# Altium schematic sheet 0163_V1P8_PCIE5 GENERAT.SchDoc
size 848 x 558 mm
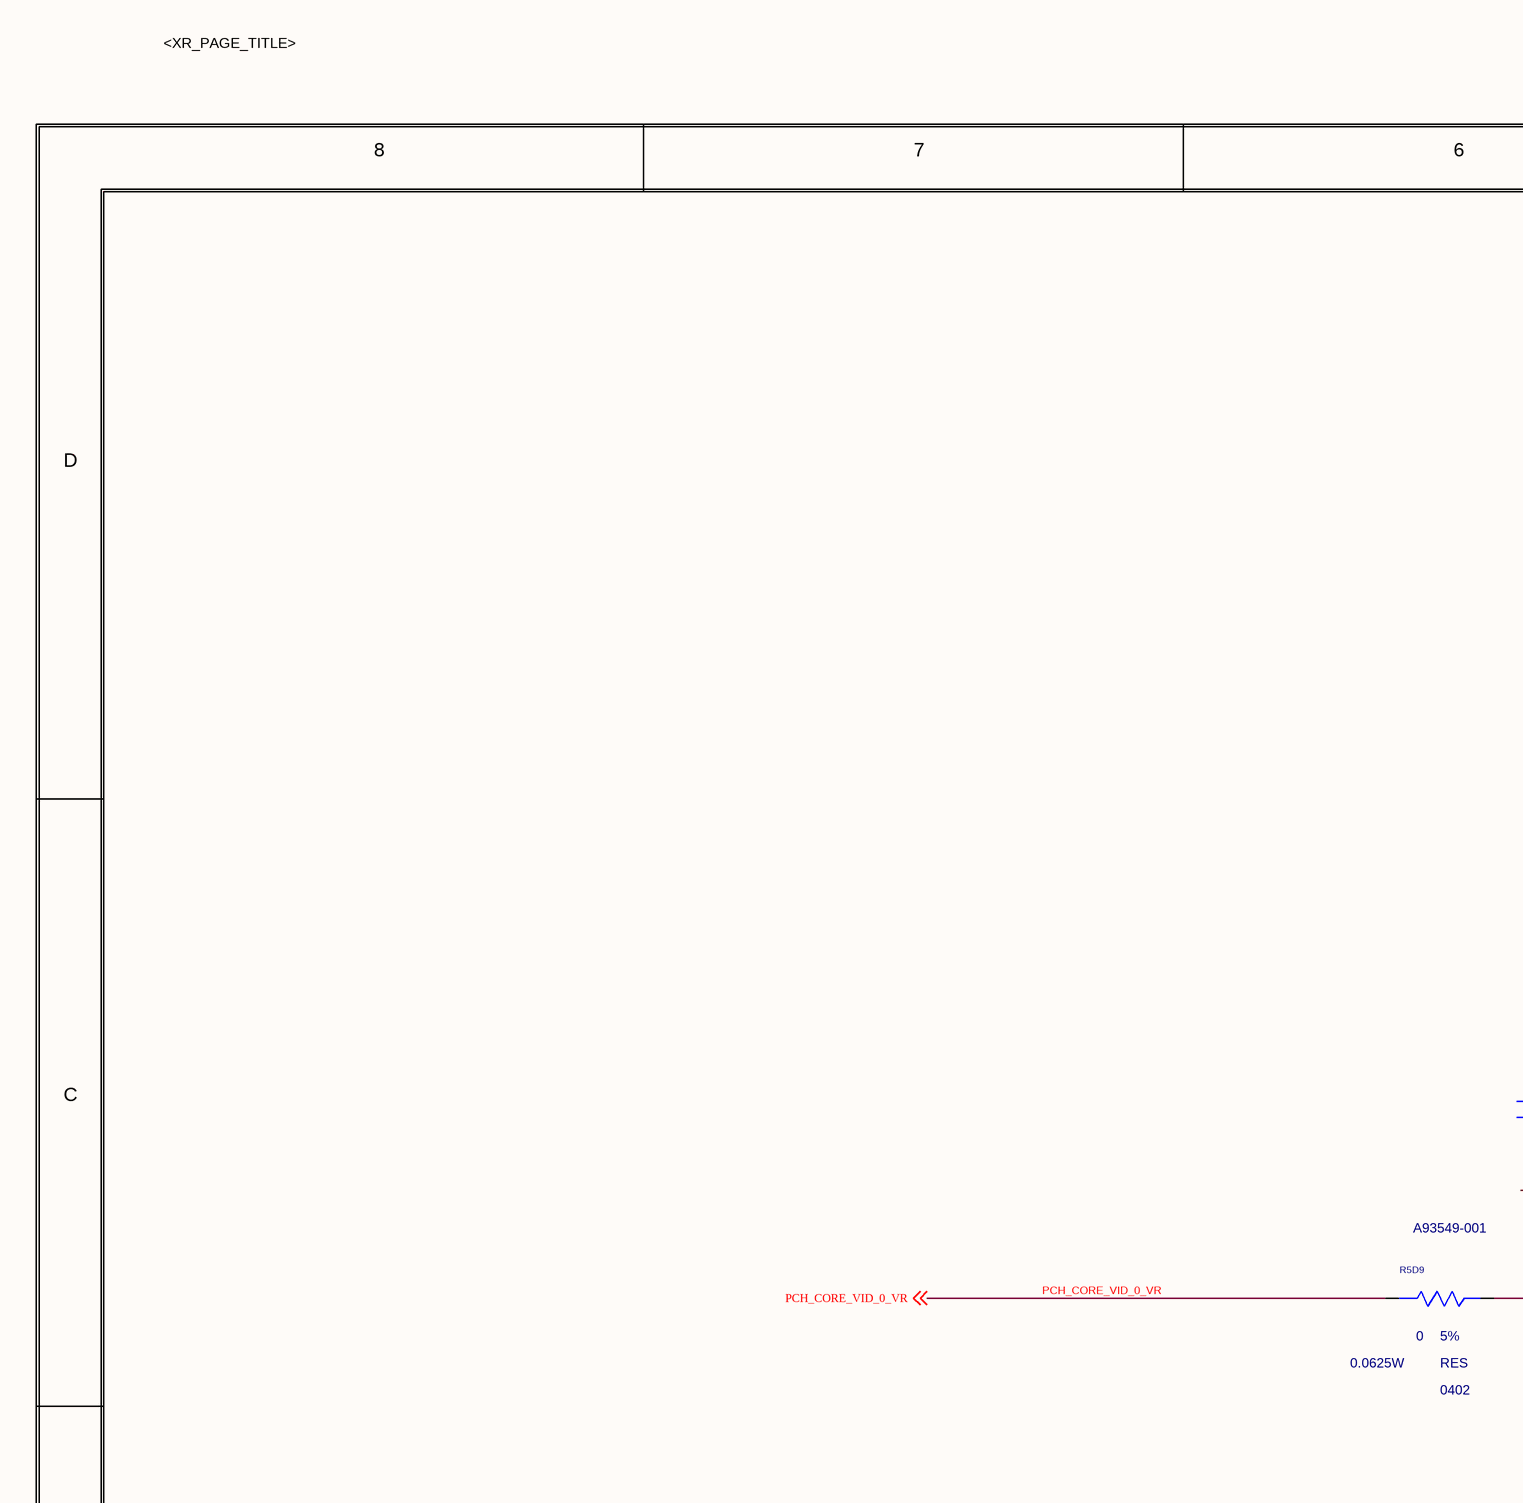
[diagram p0: 0163_V1P8_PCIE5 GENERAT.SchDoc, top left]
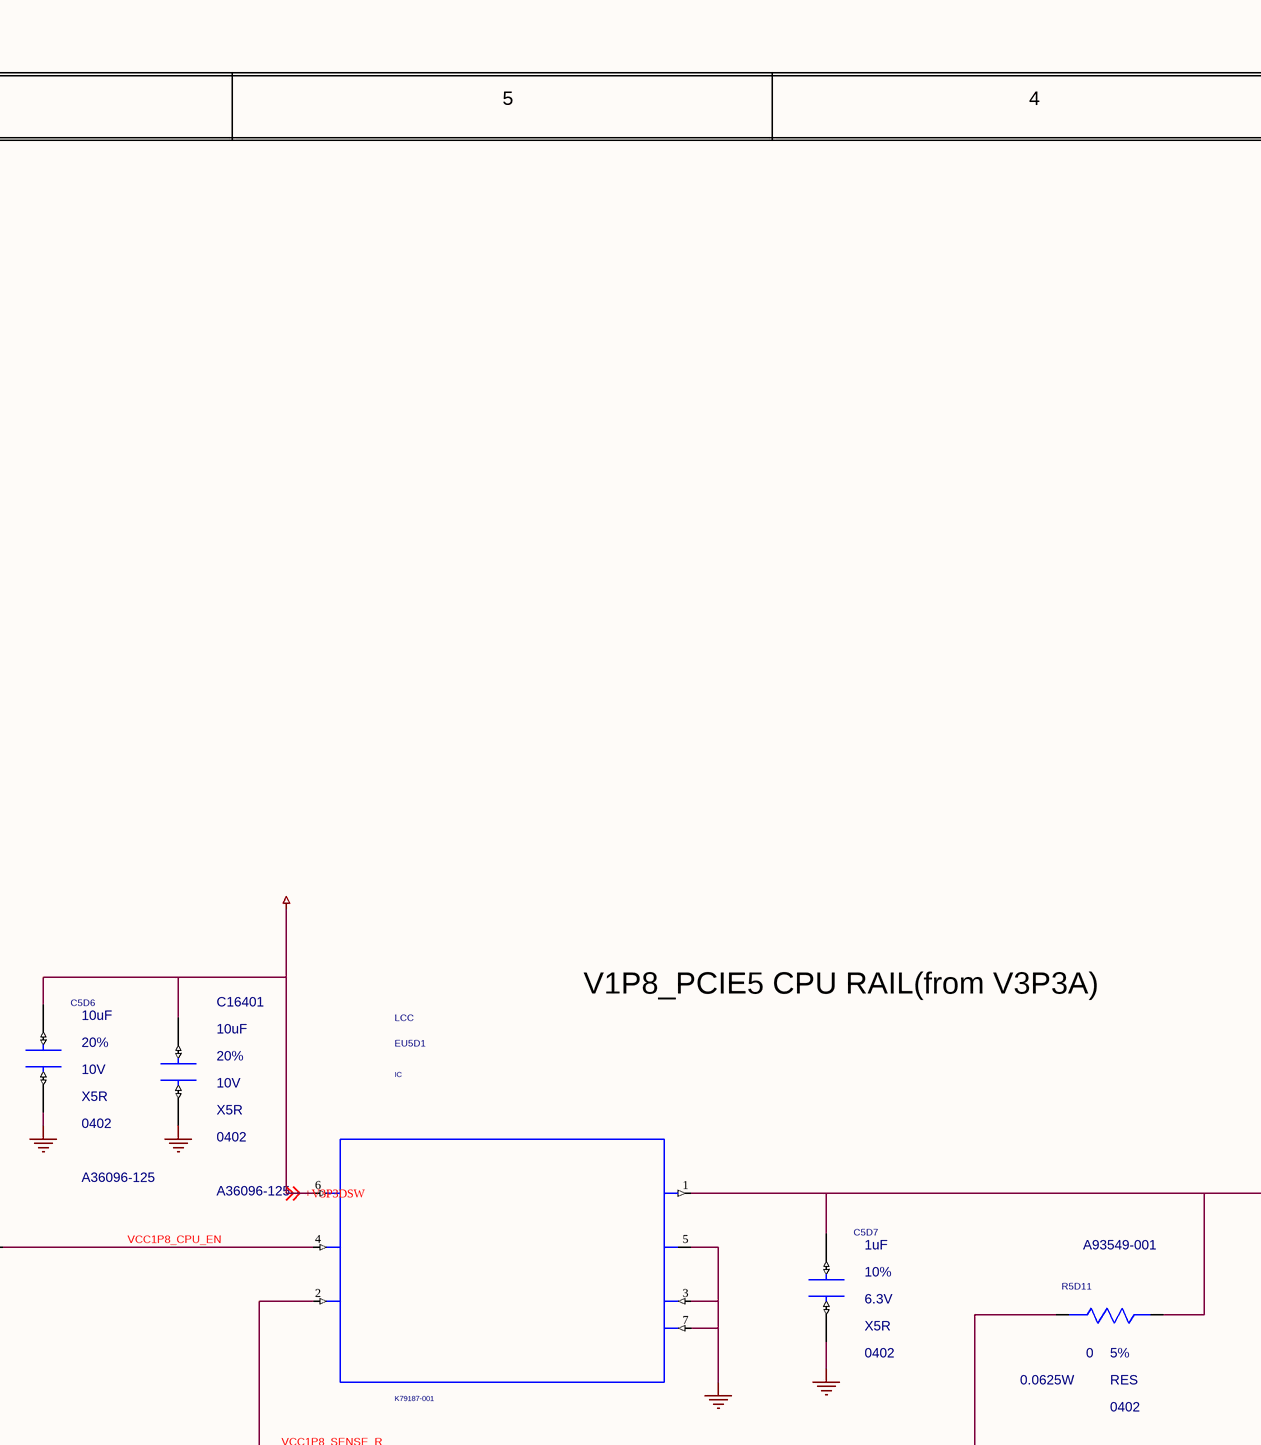
[diagram p1: 0163_V1P8_PCIE5 GENERAT.SchDoc, top middle]
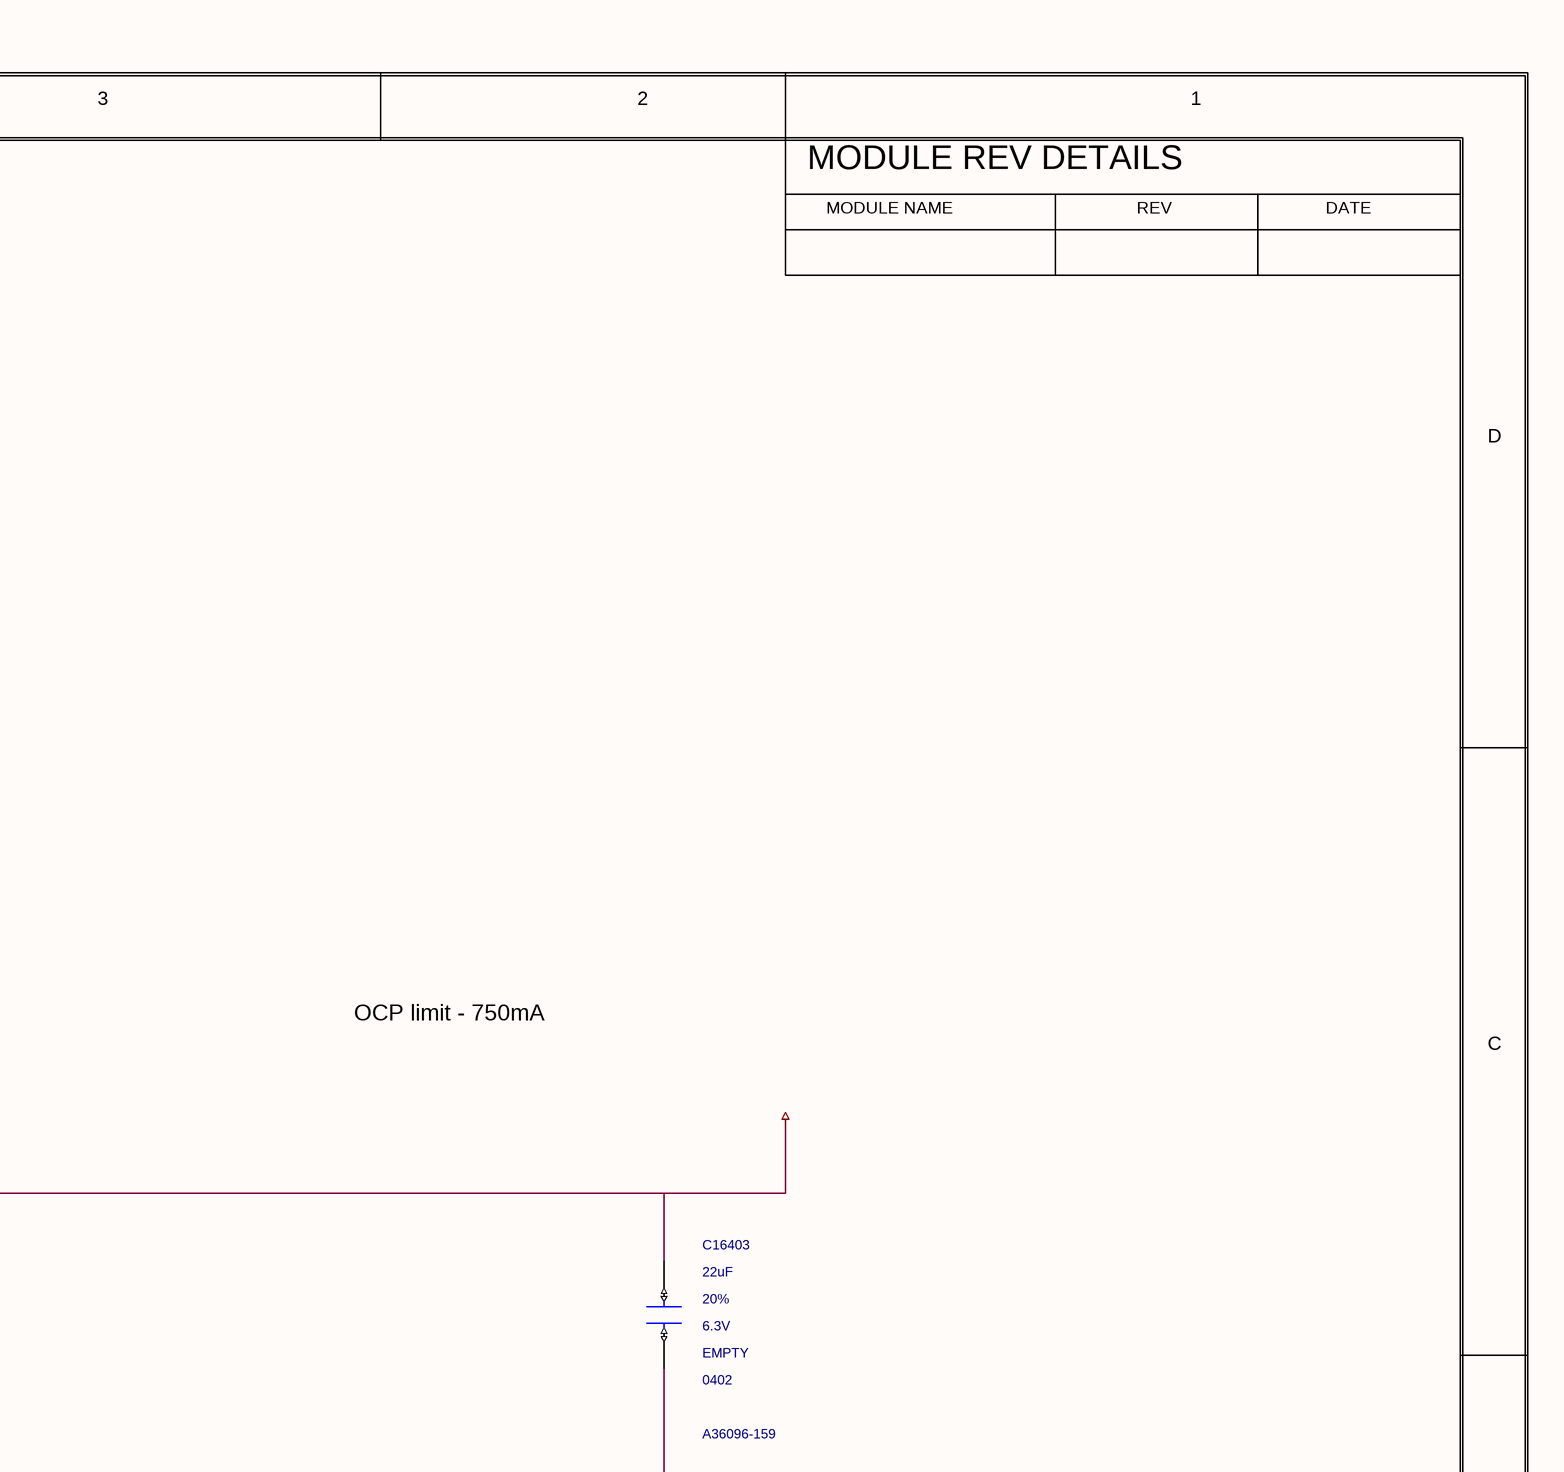
[diagram p2: 0163_V1P8_PCIE5 GENERAT.SchDoc, top right]
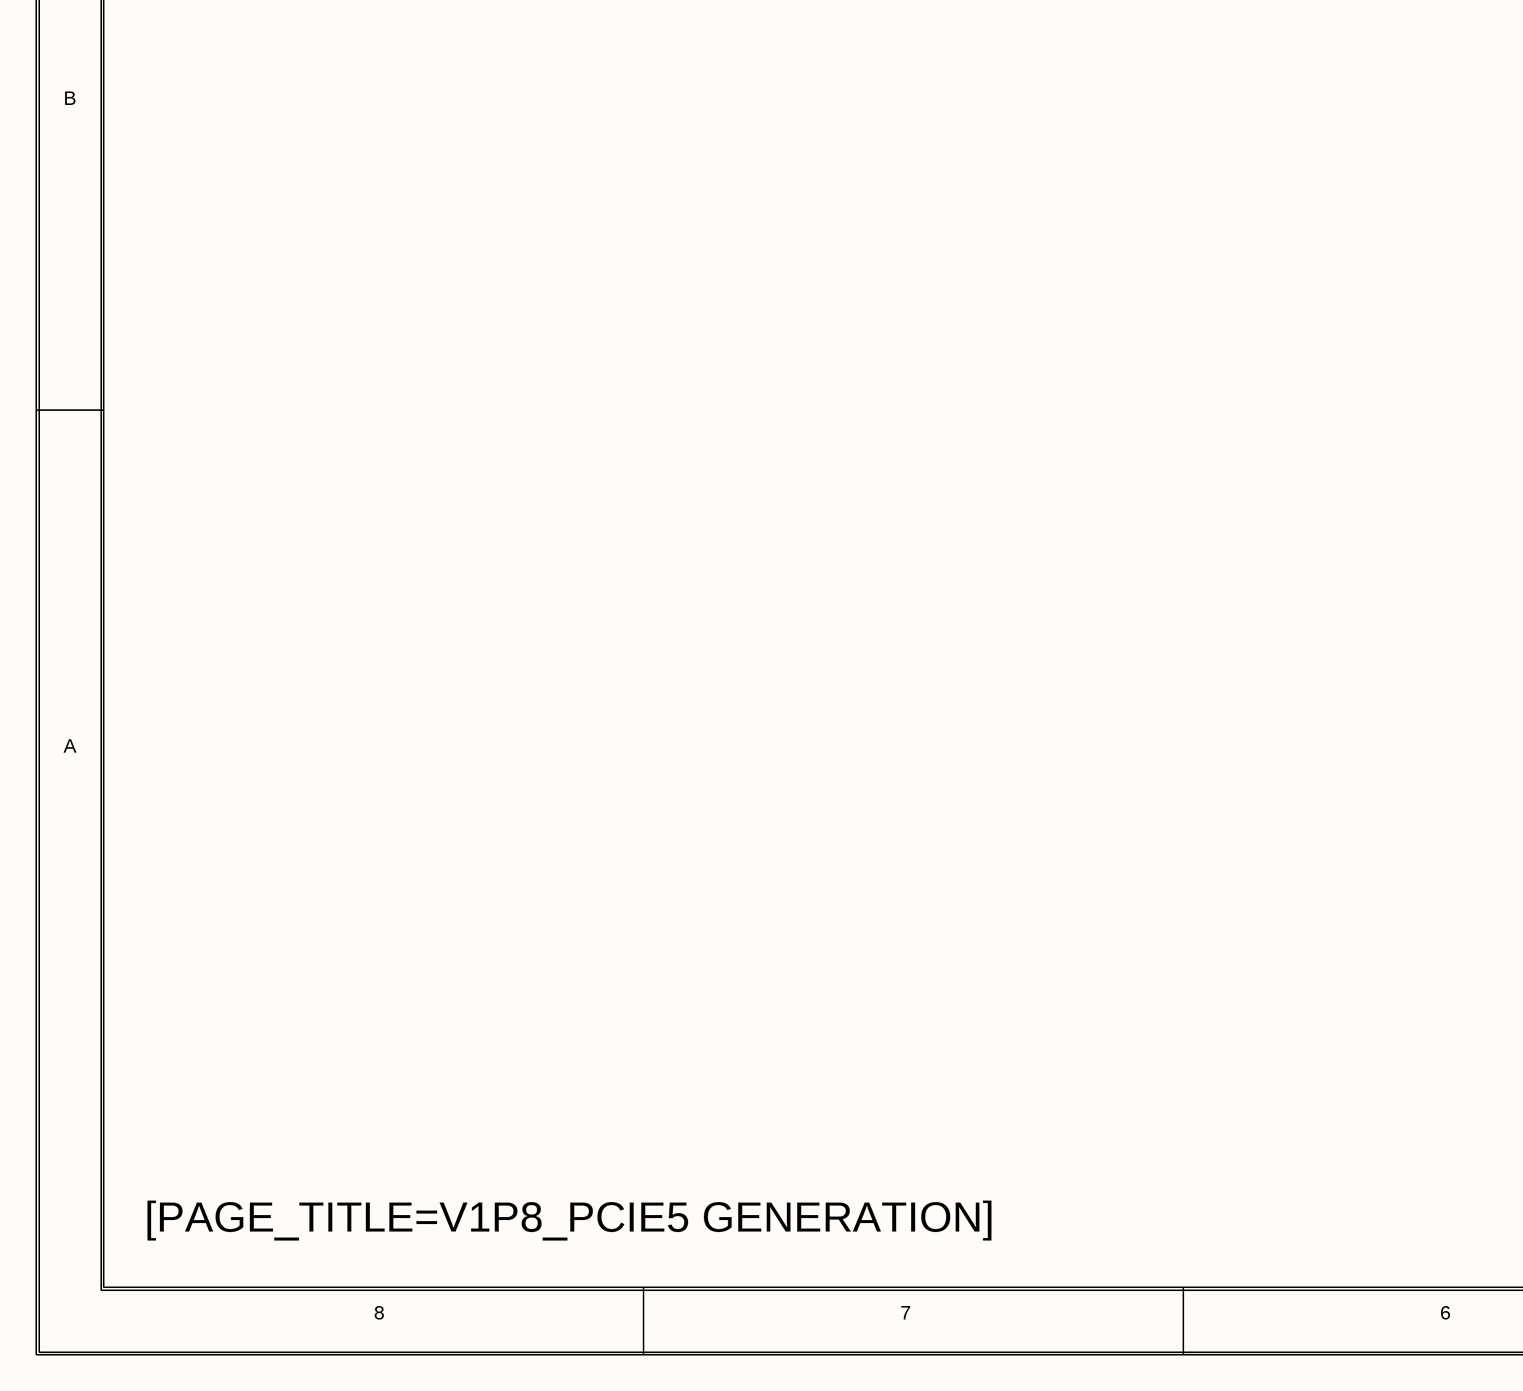
[diagram p3: 0163_V1P8_PCIE5 GENERAT.SchDoc, bottom left]
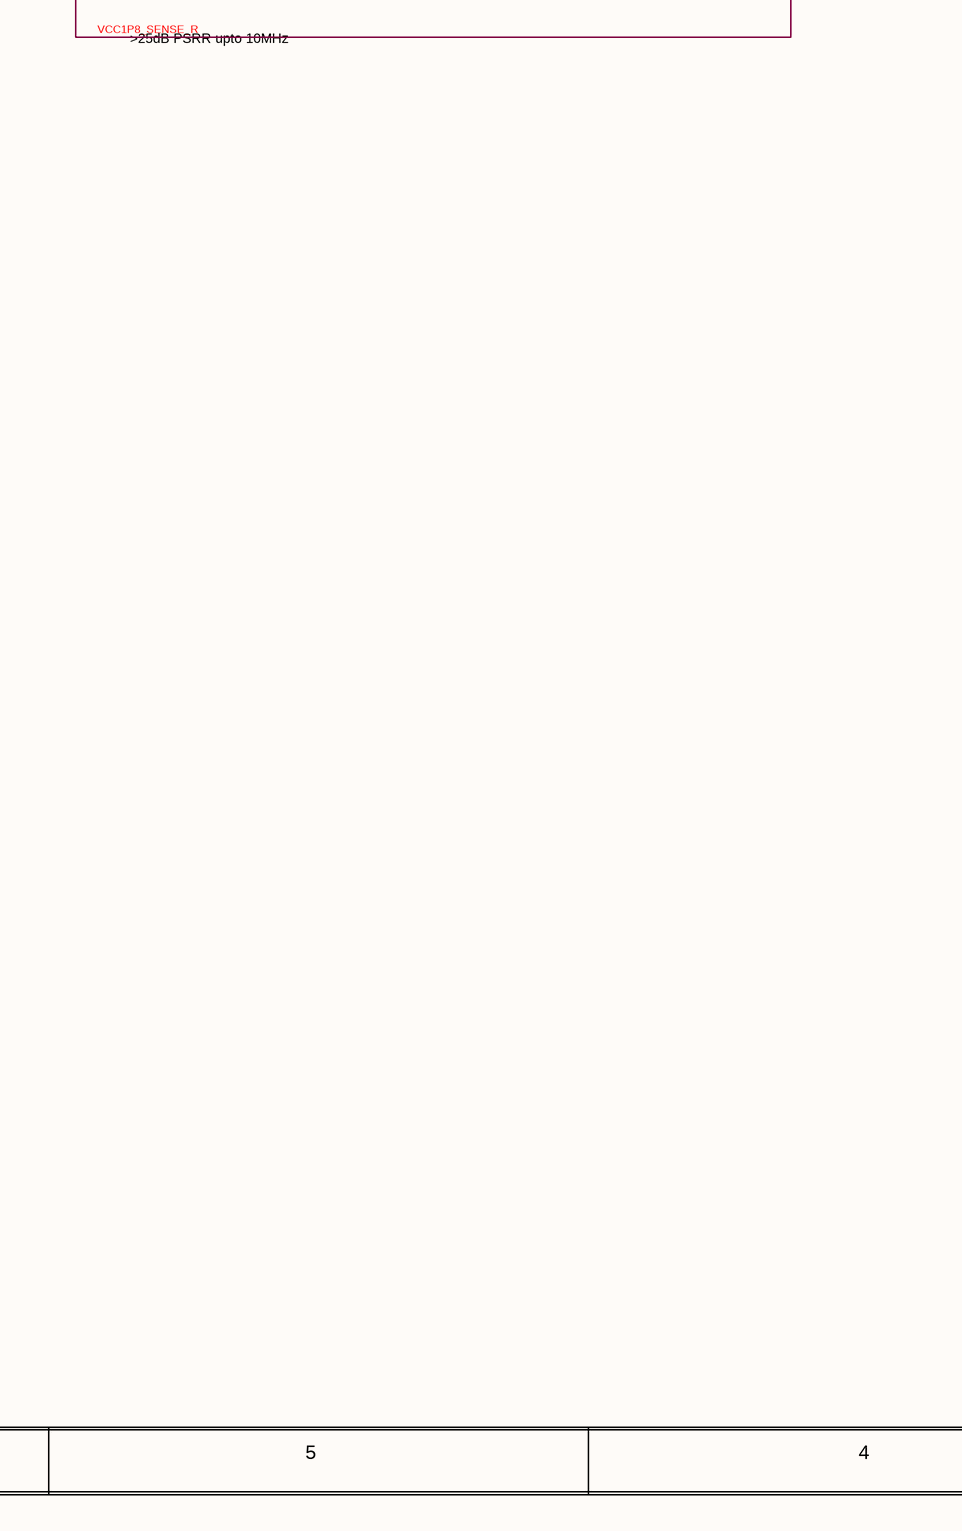
[diagram p4: 0163_V1P8_PCIE5 GENERAT.SchDoc, bottom middle]
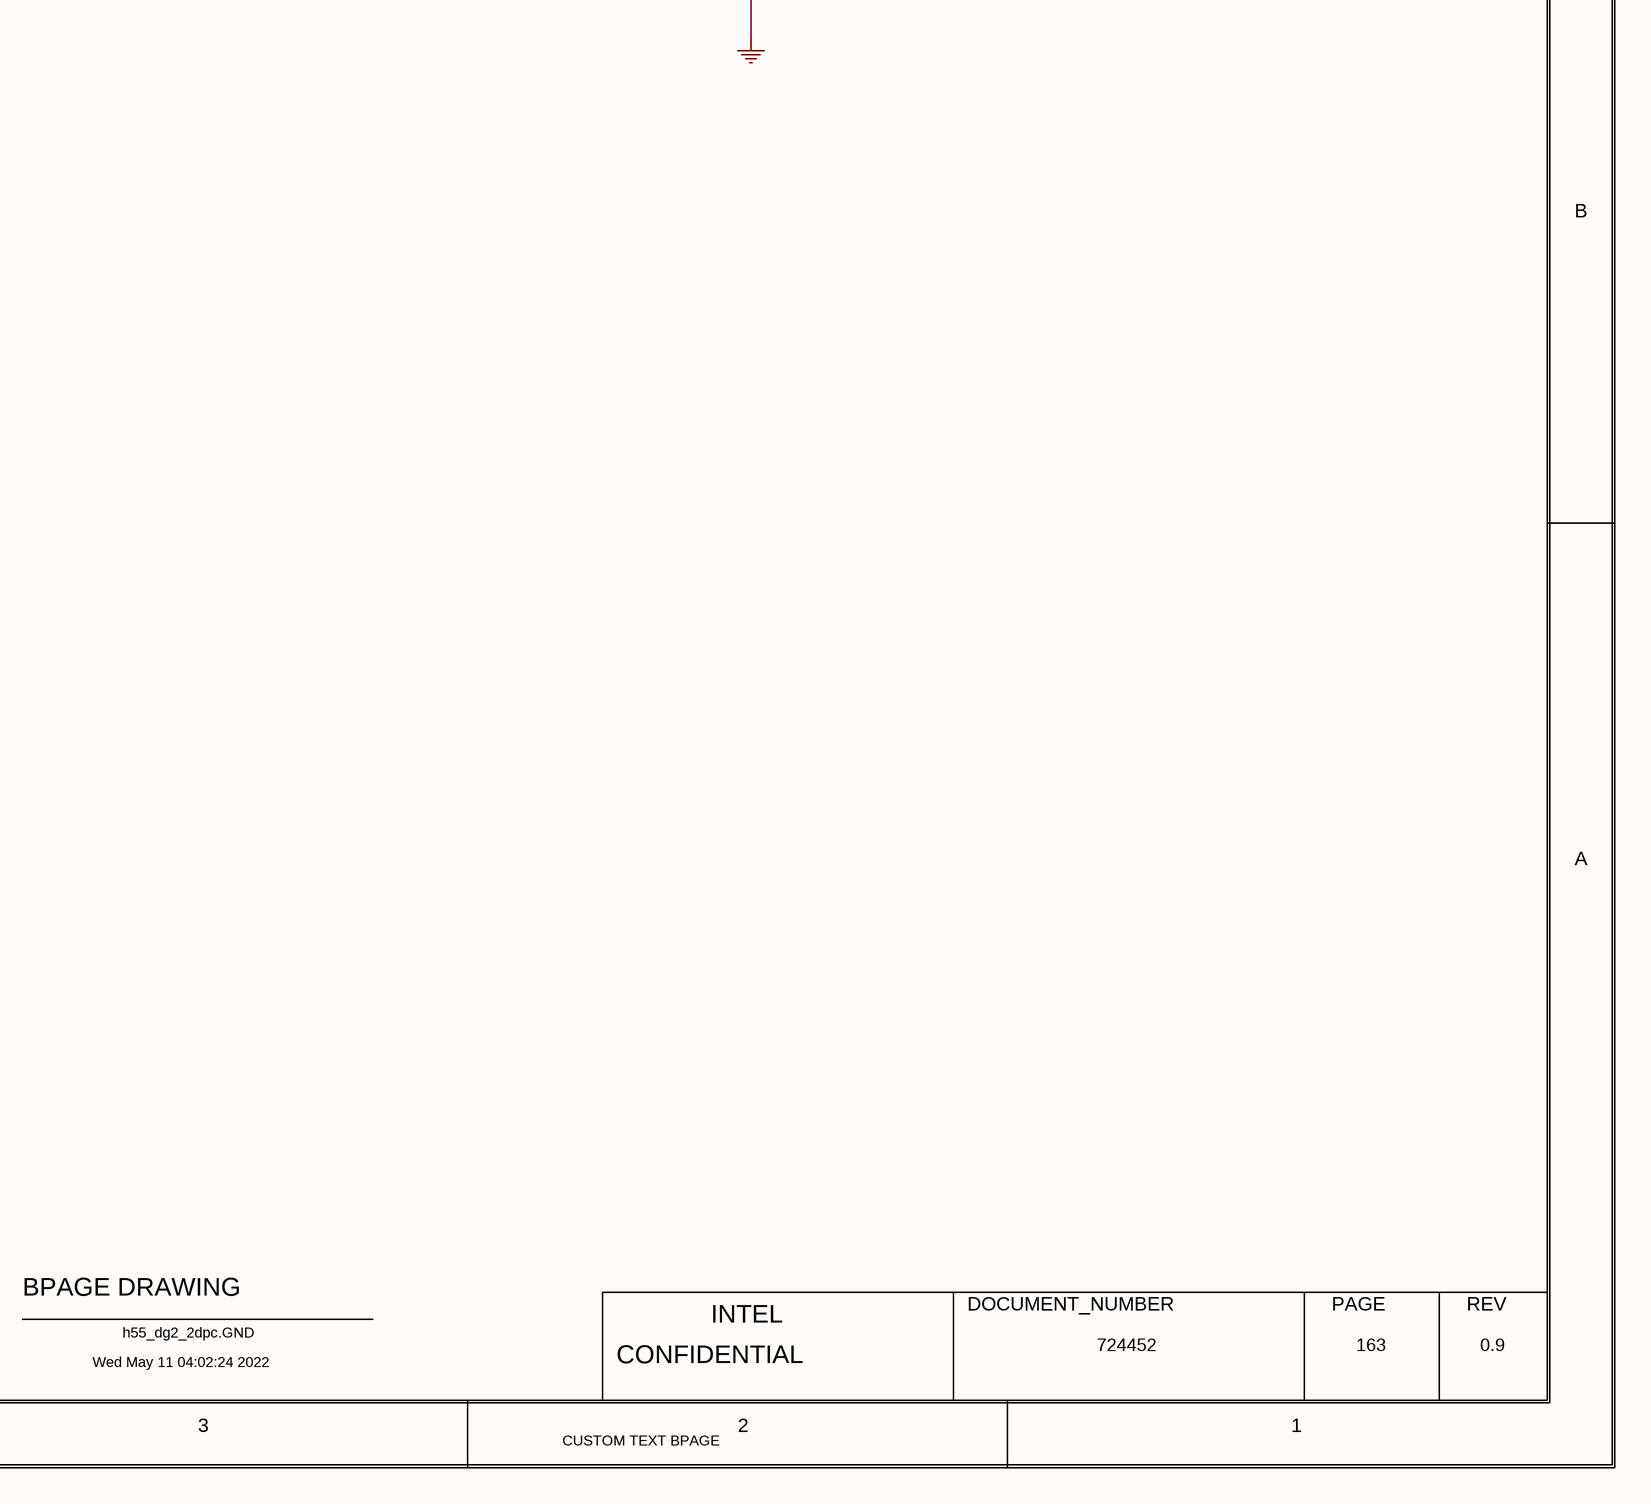
[diagram p5: 0163_V1P8_PCIE5 GENERAT.SchDoc, bottom right]

## Parts
C5D6  10uF  MATERIAL: X5R  PACK_TYPE: 0402  PART_NUMBER: A36096-125  TOLERANCE: 20%  VOLTAGE: 10V  [CTK0_SM0402_1220X700_MA]
C5D7  1uF  MATERIAL: X5R  PACK_TYPE: 0402  TOLERANCE: 10%  VOLTAGE: 6.3V  [CTK2_SM0402_1050X550_MA]
C16401  10uF  MATERIAL: X5R  PACK_TYPE: 0402  PART_NUMBER: A36096-125  TOLERANCE: 20%  VOLTAGE: 10V  [CTK0_SM0402_1220X700_MA]
C16403  22uF  MATERIAL: EMPTY  PACK_TYPE: 0402  PART_NUMBER: A36096-159  TOLERANCE: 20%  VOLTAGE: 6.3V  [CTK0_SM0402_1300X800_MA]
EU5D1  MATERIAL: IC  PACK_TYPE: LCC  PART_NUMBER: K79187-001  [TK1_LCC6_S1250_400_DF300X940_MA]  (hidden comment: NCP176_2)
R5D9  0  MATERIAL: RES  PACK_TYPE: 0402  PART_NUMBER: A93549-001  TOLERANCE: 5%  WATTAGE: 0.0625W  [CTK0_SM0402_1100X550_MA]
R5D11  0  MATERIAL: RES  PACK_TYPE: 0402  PART_NUMBER: A93549-001  TOLERANCE: 5%  WATTAGE: 0.0625W  [CTK0_SM0402_1100X550_MA]

## Nets
+V3P3DSW: C5D6.1(A) C16401.1(A) EU5D1.6(IN) ; off-sheet +V3P3DSW
+VCC1P8_PROC: C5D7.1(A) C16403.1(A) EU5D1.1(OUT) R5D11.2(B)
GND: C5D6.2(B) C5D7.2(B) C16401.2(B) C16403.2(B) EU5D1.3(GND) EU5D1.5(NC) EU5D1.7(GND_TPD)
PCH_CORE_VID_0_VR: R5D9.1(A) ; off-sheet PCH_CORE_VID_0_VR
VCC1P8_CPU_EN: EU5D1.4(EN) R5D9.2(B)
VCC1P8_SENSE_R: EU5D1.2(FB) R5D11.1(A)

## Notes on the sheet
- <XR_PAGE_TITLE>
- 8
- 7
- 6
- 5
- 4
- 3
- 2
- 1
- MODULE REV DETAILS
- MODULE NAME
- REV
- DATE
- D
- V1P8_PCIE5 CPU RAIL(from V3P3A)
- C
- OCP limit - 750mA
- >25dB PSRR upto 10MHz
- B
- A
- BPAGE DRAWING
- INTEL
- DOCUMENT_NUMBER
- PAGE
- [PAGE_TITLE=V1P8_PCIE5 GENERATION]
- Wed May 11 04:02:24 2022
- h55_dg2_2dpc.GND
- CONFIDENTIAL
- 724452
- 163
- 0.9
- CUSTOM TEXT BPAGE

## Library data of the parts
C5D6 = C_CAP: CDS_PHYS_PART_NAME: C_CAP_0402-A36096-125,X5R,10UF,10V,20%,TK0,GENERIC; CDS_LMAN_SYM_OUTLINE: -50,50,50,-50; FP_TECH: TK0; IP: GENERIC; ROOM: NONE; OriginalSymbolOrigin: (-50,25); XY: (-8200,4200); VER: 1; ROT: 0; PHYS_PAGE: 163; LOCATION: C5D6; DRAWING: @RVP1_ADL_SB_ADP_S_DDR5_SODIMM_2DPC_LIB.H55_DG2_2DPC(SCH_1):PAGE532; CDS_LIB: c_discrete; VARIANT: ?; PCB Footprint: CTK0_SM0402_1220X700_MA; CHIPS_PART_NAME: C_CAP; CDS_PART_NAME: C_CAP_0402-A36096-125,X5R,10UF,10V,20%,TK0,GENERIC; CDS_LOCATION: C5D6; ASI_MODEL: A36096-125
C5D7 = C_CAP: PART_NUMBER: A36096-027; CDS_PHYS_PART_NAME: CAP_402-1UF,10%,16V"; CDS_PART_NAME: C_CAP_0402-A36096-027,X5R,1UF,6.3V,10%,TK2,GENERIC; CDS_LMAN_SYM_OUTLINE: -50,50,50,-50; FP_TECH: TK2; IP: GENERIC; ROOM: NONE; OriginalSymbolOrigin: (-50,25); XY: (-6750,3775); VER: 1; ROT: 0; PHYS_PAGE: 163; LOCATION: C5D7; DRAWING: @RVP1_ADL_SB_ADP_S_DDR5_SODIMM_2DPC_LIB.H55_DG2_2DPC(SCH_1):PAGE532; CDS_LIB: c_discrete; VARIANT: ?; PCB Footprint: CTK2_SM0402_1050X550_MA; CHIPS_PART_NAME: C_CAP; CDS_LOCATION: C5D7; ASI_MODEL: A36096-027
C16401 = C_CAP: CDS_PHYS_PART_NAME: C_CAP_0402-A36096-125,X5R,10UF,10V,20%,TK0,GENERIC; CDS_LMAN_SYM_OUTLINE: -50,50,50,-50; FP_TECH: TK0; IP: GENERIC; ROOM: NONE; OriginalSymbolOrigin: (-50,25); XY: (-7950,4175); VER: 1; ROT: 0; PHYS_PAGE: 163; LOCATION: C16401; DRAWING: @RVP1_ADL_SB_ADP_S_DDR5_SODIMM_2DPC_LIB.H55_DG2_2DPC(SCH_1):PAGE532; CDS_LIB: c_discrete; VARIANT: ?; PCB Footprint: CTK0_SM0402_1220X700_MA; CHIPS_PART_NAME: C_CAP; CDS_PART_NAME: C_CAP_0402-A36096-125,X5R,10UF,10V,20%,TK0,GENERIC; CDS_LOCATION: C16401; ASI_MODEL: A36096-125
C16403 = C_CAP: CDS_PHYS_PART_NAME: C_CAP_0402-A36096-159,EMPTY,22UF,6.3V,20%,TK0,GENERIC; CDS_LMAN_SYM_OUTLINE: -50,50,50,-50; FP_TECH: TK0; IP: GENERIC; ROOM: NONE; OriginalSymbolOrigin: (-50,25); XY: (-4325,3725); VER: 1; ROT: 0; PHYS_PAGE: 163; LOCATION: C16403; DRAWING: @RVP1_ADL_SB_ADP_S_DDR5_SODIMM_2DPC_LIB.H55_DG2_2DPC(SCH_1):PAGE532; CDS_LIB: c_discrete; VARIANT: ?; PCB Footprint: CTK0_SM0402_1300X800_MA; CHIPS_PART_NAME: C_CAP; CDS_PART_NAME: C_CAP_0402-A36096-159,EMPTY,22UF,6.3V,20%,TK0,GENERIC; CDS_LOCATION: C16403
EU5D1 = NCP176_2: CDS_PHYS_PART_NAME: NCP176_2_LCC-K79187-001,IC,NCP176BMX180TCG,TK1,GENERIC; CDS_LMAN_SYM_OUTLINE: -200,250,200,-200; FP_TECH: TK1; IP: GENERIC; ROOM: NONE; OriginalSymbolOrigin: (-325,250); XY: (-7350,3800); VER: 1; ROT: 0; PHYS_PAGE: 163; LOCATION: EU5D1; DRAWING: @RVP1_ADL_SB_ADP_S_DDR5_SODIMM_2DPC_LIB.H55_DG2_2DPC(SCH_1):PAGE532; CDS_LIB: vreg_2; VARIANT: ?; PCB Footprint: TK1_LCC6_S1250_400_DF300X940_MA; SEC_TYPE: LCC; CHIPS_PART_NAME: NCP176_2; CDS_PART_NAME: NCP176_2_LCC-K79187-001,IC,NCP176BMX180TCG,TK1,GENERIC; CDS_LOCATION: EU5D1; ASI_MODEL: K79187-001
R5D9 = C_RES#1: CHIPS_PART_NAME: C_RES; CDS_PHYS_PART_NAME: C_RES_0402-A93549-001,RES,0,5%,0.0625W,TK0,GENERIC; CDS_LMAN_SYM_OUTLINE: -50,50,50,-50; FP_TECH: TK0; IP: GENERIC; ROOM: NONE; OriginalSymbolOrigin: (-75,25); XY: (-8375,3850); VER: 1; PHYS_PAGE: 163; LOCATION: R5D9; DRAWING: @RVP1_ADL_SB_ADP_S_DDR5_SODIMM_2DPC_LIB.H55_DG2_2DPC(SCH_1):PAGE532; CDS_LIB: c_discrete; VARIANT: ?; PCB Footprint: CTK0_SM0402_1100X550_MA; ROT: 0; CDS_PART_NAME: C_RES_0402-A93549-001,RES,0,5%,0.0625W,TK0,GENERIC; CDS_LOCATION: R5D9; ASI_MODEL: A93549-001
R5D11 = C_RES#1: CHIPS_PART_NAME: C_RES; CDS_PHYS_PART_NAME: C_RES_0402-A93549-001,RES,0,5%,0.0625W,TK0,GENERIC; CDS_LMAN_SYM_OUTLINE: -50,50,50,-50; FP_TECH: TK0; IP: GENERIC; ROOM: NONE; OriginalSymbolOrigin: (-75,25); XY: (-6225,3725); VER: 1; PHYS_PAGE: 163; LOCATION: R5D11; DRAWING: @RVP1_ADL_SB_ADP_S_DDR5_SODIMM_2DPC_LIB.H55_DG2_2DPC(SCH_1):PAGE532; CDS_LIB: c_discrete; VARIANT: ?; PCB Footprint: CTK0_SM0402_1100X550_MA; ROT: 0; CDS_PART_NAME: C_RES_0402-A93549-001,RES,0,5%,0.0625W,TK0,GENERIC; CDS_LOCATION: R5D11; ASI_MODEL: A93549-001